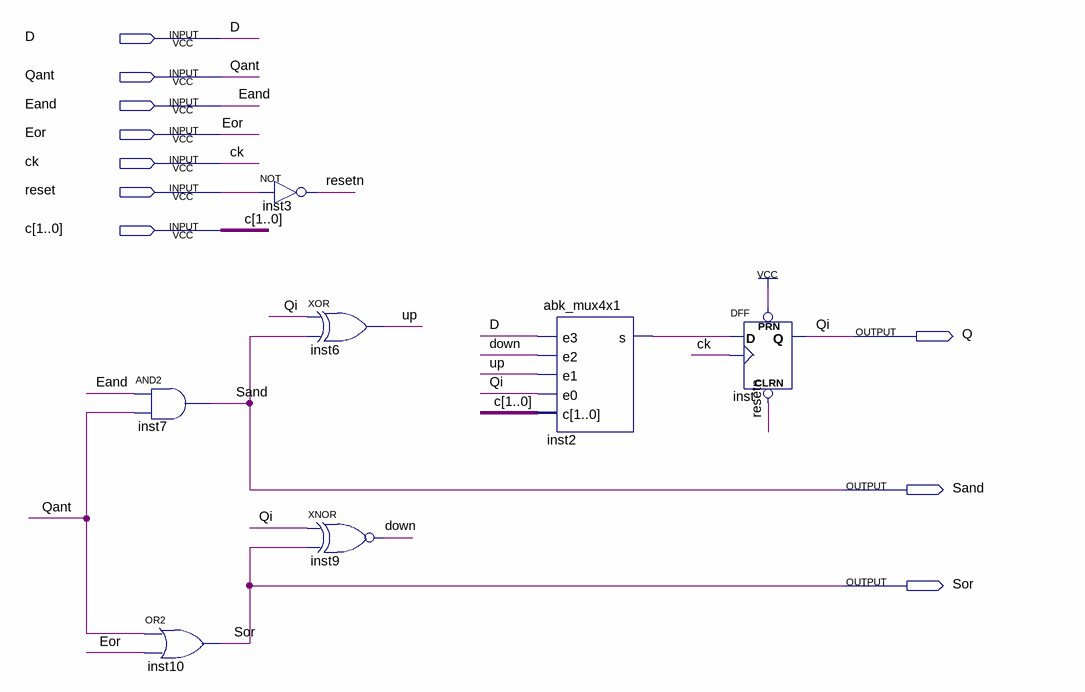
[diagram p0: schematic sheet]
// Quartus schematic abk_contador_generico.bdf as structural Verilog: 7 symbols, 10 pins
module abk_contador_generico (
  input  D,
  input  Qant,
  input  Eand,
  input  Eor,
  input  ck,
  input  reset,
  input  [1:0] c,
  output Q,
  output Sand,
  output Sor
);

  wire down, inst2_s, resetn, up;

  and inst7 (Sand, Eand, Qant);
  or inst10 (Sor, Qant, Eor);
  not inst3 (resetn, reset);
  xor inst6 (up, Q, Sand);
  xnor inst9 (down, Q, Sor);
  abk_mux4x1 inst2 (.e3(D), .e2(down), .e1(up), .e0(Q), .c(c), .s(inst2_s));
  DFF inst (.CLRN(resetn), .CLK(ck), .D(inst2_s), .PRN(1'b1), .Q(Q));

  // Other names for the same wires on the sheet: Qi = Q
endmodule
